# EAGLE design GEO-HEX-1.0.0 (EAGLE 9.6.2)

## Sheet 1 of 4
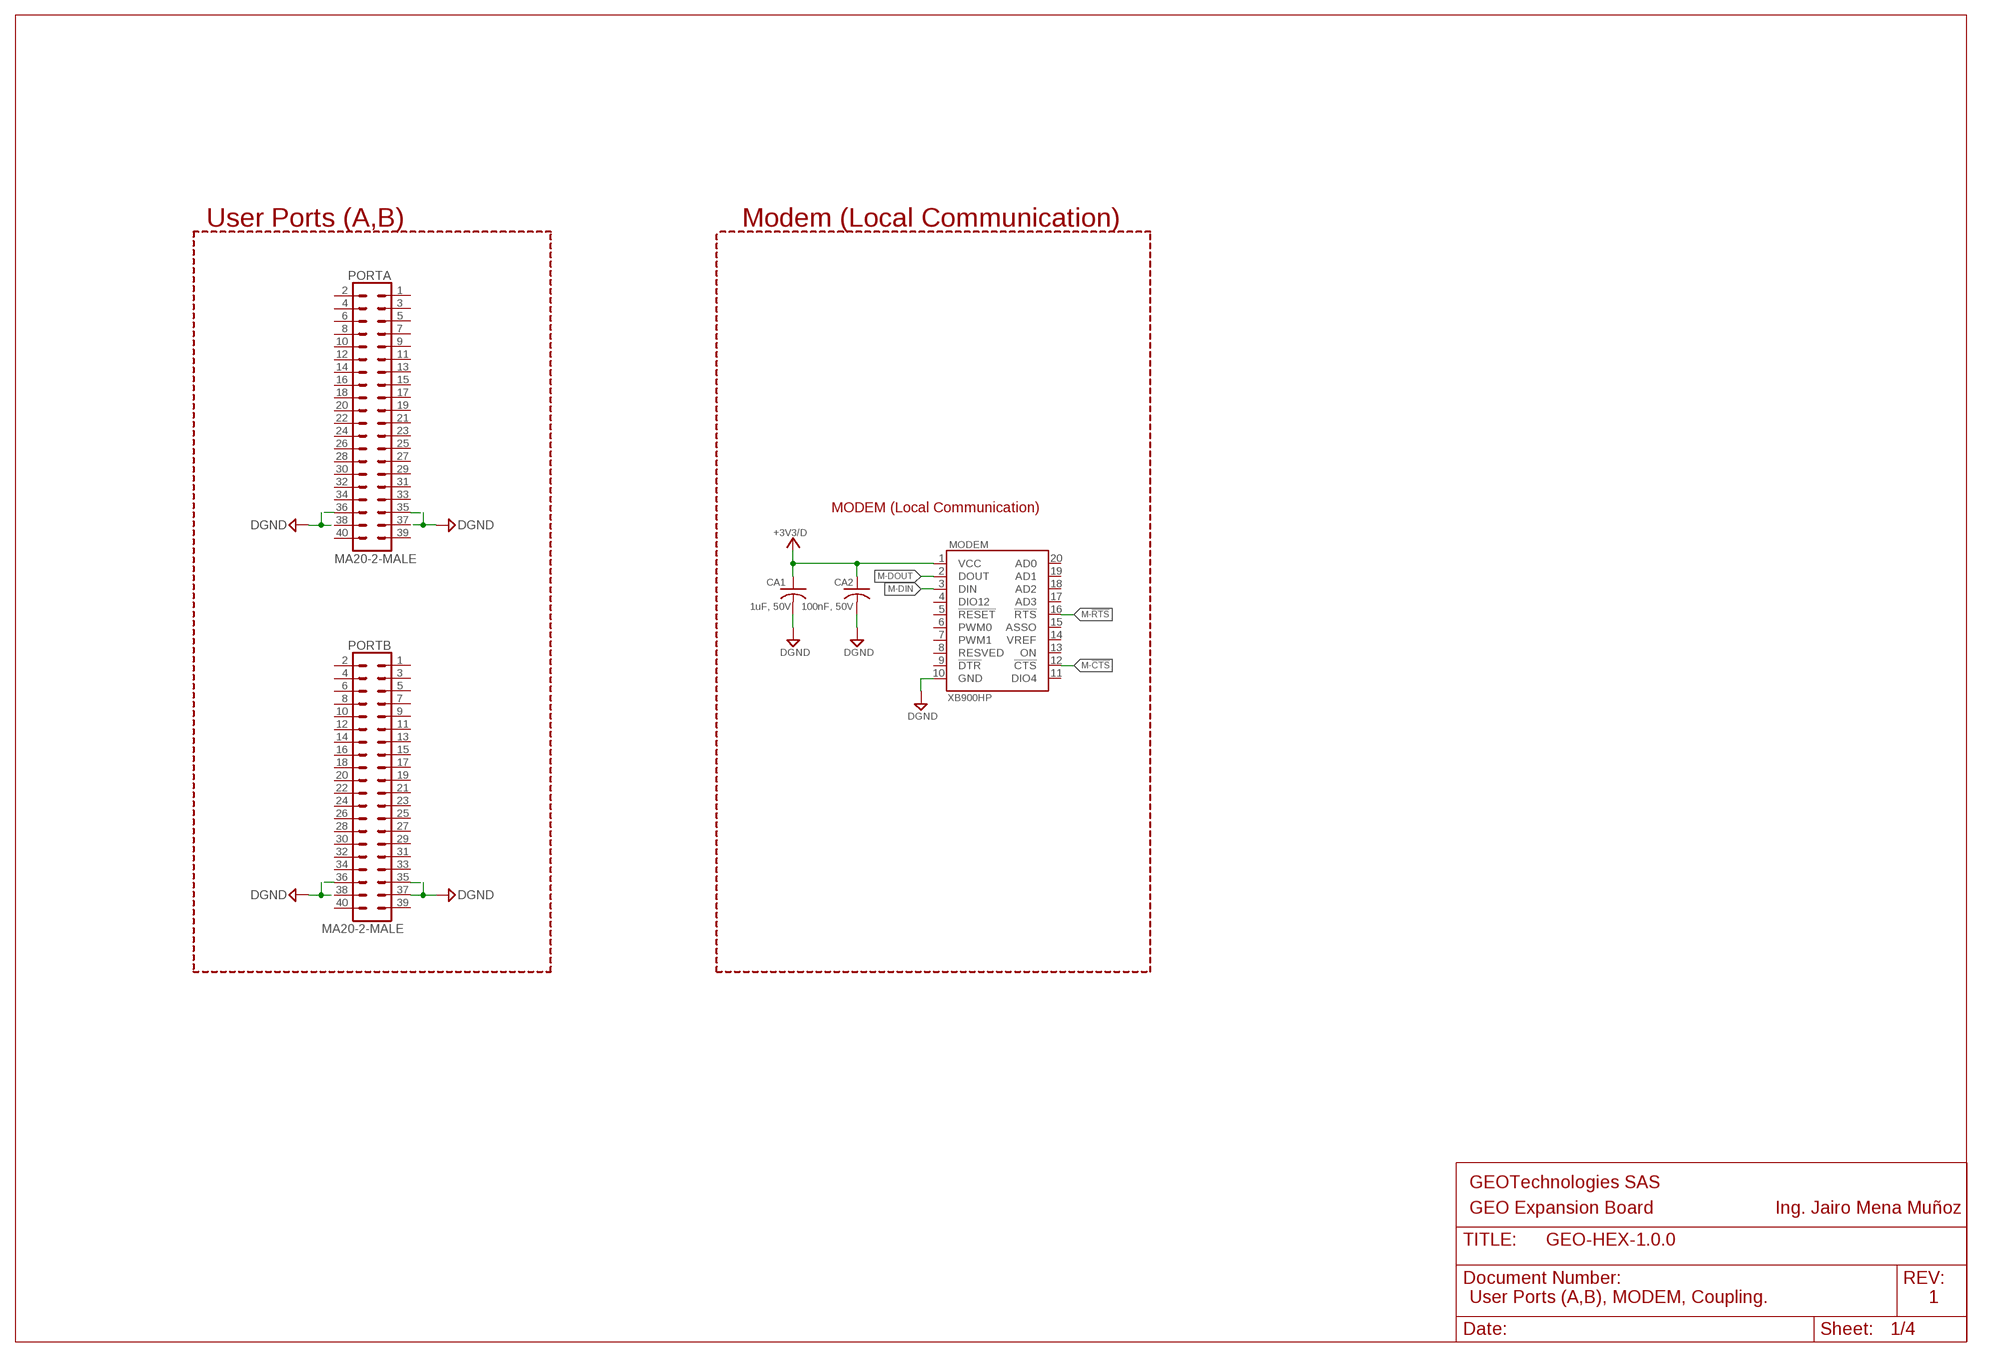
[diagram p0: schematic, sheet 1]

### Parts
CA1  1uF, 50V  C-US1UF-0805  [C0805]
CA2  100nF, 50V  C-US100NF-0805  [C0805]
MODEM  XB900HP  XBEEPROXBP9B-DMST-002  [XBEEPRO]
PORTA  MA20-2-MALE  [MA20-2-MALE]
PORTB  MA20-2-MALE  [MA20-2-MALE]

### Nets
+3V3/D: CA1.1 CA2.1 MODEM.1(VCC) ; also sheet 4
DGND: CA1.2 CA2.2 MODEM.10(GND) PORTA.35 PORTA.36 PORTA.37 PORTA.38 PORTB.35 PORTB.36 PORTB.37 PORTB.38
M-!CTS: MODEM.12(!CTS)
M-!RTS: MODEM.16(!RTS)
M-DIN: MODEM.3(DIN)
M-DOUT: MODEM.2(DOUT)
Unconnected: MODEM.4(DIO12) MODEM.5(!RESET) MODEM.6(PWM0) MODEM.7(PWM1) MODEM.8(RESVED) MODEM.9(!DTR) MODEM.11(DIO4) MODEM.13(ON) MODEM.14(VREF) MODEM.15(ASSO) MODEM.17(AD3) MODEM.18(AD2) MODEM.19(AD1) MODEM.20(AD0) PORTA.1 PORTA.2 PORTA.3 PORTA.4 PORTA.5 PORTA.6 PORTA.7 PORTA.8 PORTA.9 PORTA.10 PORTA.11 PORTA.12 PORTA.13 PORTA.14 PORTA.15 PORTA.16 PORTA.17 PORTA.18 PORTA.19 PORTA.20 PORTA.21 PORTA.22 PORTA.23 PORTA.24 PORTA.25 PORTA.26 PORTA.27 PORTA.28 PORTA.29 PORTA.30 PORTA.31 PORTA.32 PORTA.33 PORTA.34 PORTA.39 PORTA.40 PORTB.1 PORTB.2 PORTB.3 PORTB.4 PORTB.5 PORTB.6 PORTB.7 PORTB.8 PORTB.9 PORTB.10 PORTB.11 PORTB.12 PORTB.13 PORTB.14 PORTB.15 PORTB.16 PORTB.17 PORTB.18 PORTB.19 PORTB.20 PORTB.21 PORTB.22 PORTB.23 PORTB.24 PORTB.25 PORTB.26 PORTB.27 PORTB.28 PORTB.29 PORTB.30 PORTB.31 PORTB.32 PORTB.33 PORTB.34 PORTB.39 PORTB.40

### Notes on the sheet
- User Ports (A,B) | Modem (Local Communication)
- MODEM (Local Communication)
- GEOTechnologies SAS
- GEO Expansion Board | Ing. Jairo Mena Muñoz
- User Ports (A,B), MODEM, Coupling. | 1

## Sheet 2 of 4
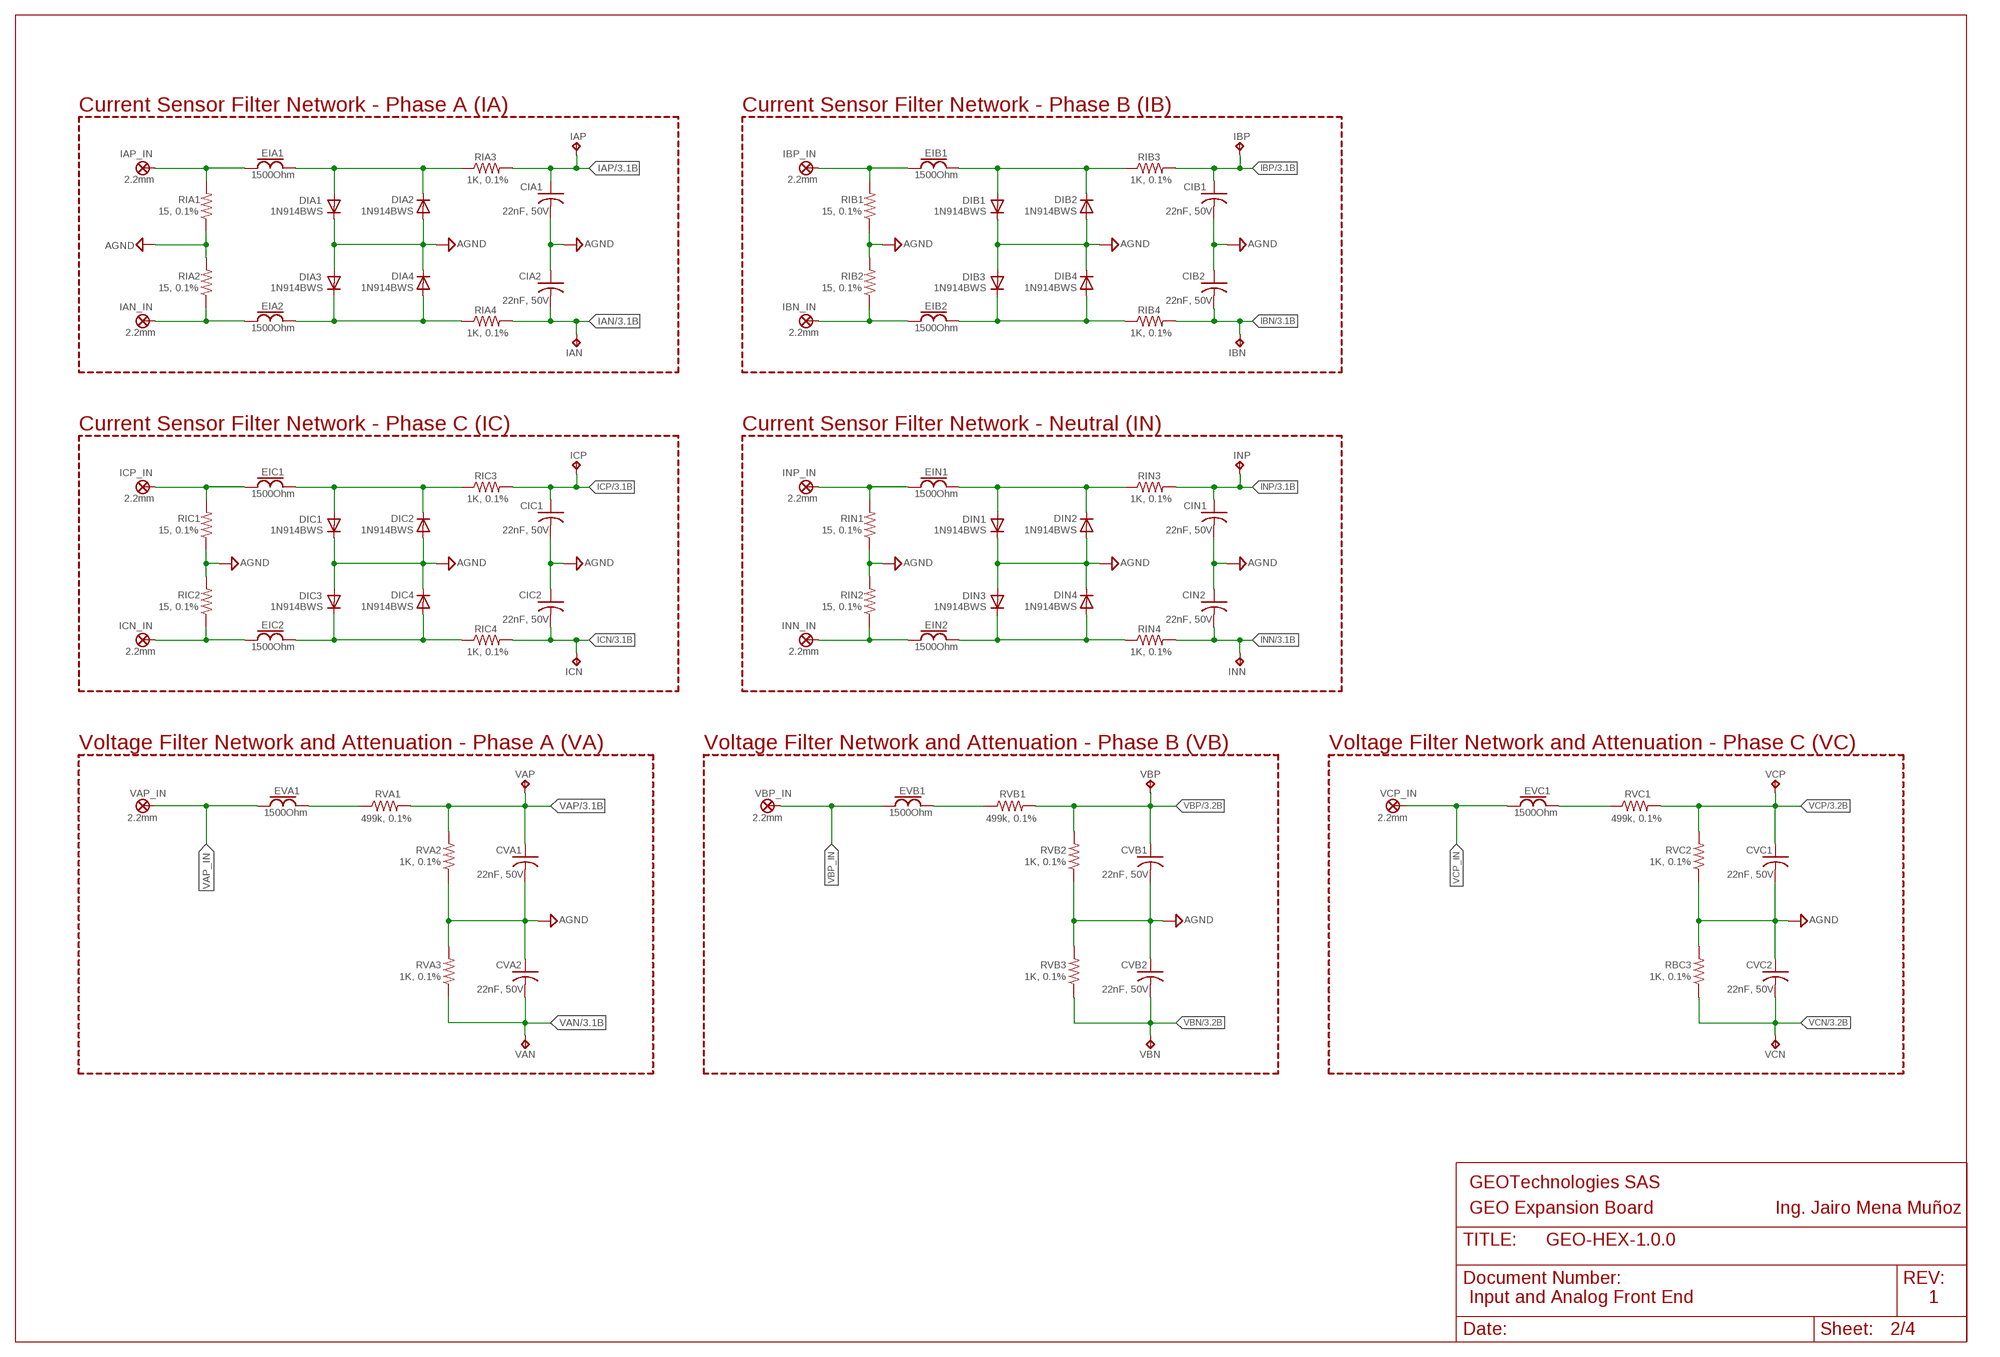
[diagram p1: schematic, sheet 2]

### Parts
CIA1  22nF, 50V  C-US22NF-0805  [C0805]
CIA2  22nF, 50V  C-US22NF-0805  [C0805]
CIB1  22nF, 50V  C-US22NF-0805  [C0805]
CIB2  22nF, 50V  C-US22NF-0805  [C0805]
CIC1  22nF, 50V  C-US22NF-0805  [C0805]
CIC2  22nF, 50V  C-US22NF-0805  [C0805]
CIN1  22nF, 50V  C-US22NF-0805  [C0805]
CIN2  22nF, 50V  C-US22NF-0805  [C0805]
CVA1  22nF, 50V  C-US22NF-0805  [C0805]
CVA2  22nF, 50V  C-US22NF-0805  [C0805]
CVB1  22nF, 50V  C-US22NF-0805  [C0805]
CVB2  22nF, 50V  C-US22NF-0805  [C0805]
CVC1  22nF, 50V  C-US22NF-0805  [C0805]
CVC2  22nF, 50V  C-US22NF-0805  [C0805]
DIA1  1N914BWS  D1N914BWS  [SOD-323FL]
DIA2  1N914BWS  D1N914BWS  [SOD-323FL]
DIA3  1N914BWS  D1N914BWS  [SOD-323FL]
DIA4  1N914BWS  D1N914BWS  [SOD-323FL]
DIB1  1N914BWS  D1N914BWS  [SOD-323FL]
DIB2  1N914BWS  D1N914BWS  [SOD-323FL]
DIB3  1N914BWS  D1N914BWS  [SOD-323FL]
DIB4  1N914BWS  D1N914BWS  [SOD-323FL]
DIC1  1N914BWS  D1N914BWS  [SOD-323FL]
DIC2  1N914BWS  D1N914BWS  [SOD-323FL]
DIC3  1N914BWS  D1N914BWS  [SOD-323FL]
DIC4  1N914BWS  D1N914BWS  [SOD-323FL]
DIN1  1N914BWS  D1N914BWS  [SOD-323FL]
DIN2  1N914BWS  D1N914BWS  [SOD-323FL]
DIN3  1N914BWS  D1N914BWS  [SOD-323FL]
DIN4  1N914BWS  D1N914BWS  [SOD-323FL]
EIA1  1500Ohm  FBL0805  [L0805]
EIA2  1500Ohm  FBL0805  [L0805]
EIB1  1500Ohm  FBL0805  [L0805]
EIB2  1500Ohm  FBL0805  [L0805]
EIC1  1500Ohm  FBL0805  [L0805]
EIC2  1500Ohm  FBL0805  [L0805]
EIN1  1500Ohm  FBL0805  [L0805]
EIN2  1500Ohm  FBL0805  [L0805]
EVA1  1500Ohm  FBL0805  [L0805]
EVB1  1500Ohm  FBL0805  [L0805]
EVC1  1500Ohm  FBL0805  [L0805]
IAN  TPPAD1-13  [P1-10]
IAN_IN  2.2mm  TURRET  [TURRET]
IAP  TPPAD1-13  [P1-10]
IAP_IN  2.2mm  TURRET  [TURRET]
IBN  TPPAD1-13  [P1-10]
IBN_IN  2.2mm  TURRET  [TURRET]
IBP  TPPAD1-13  [P1-10]
IBP_IN  2.2mm  TURRET  [TURRET]
ICN  TPPAD1-13  [P1-10]
ICN_IN  2.2mm  TURRET  [TURRET]
ICP  TPPAD1-13  [P1-10]
ICP_IN  2.2mm  TURRET  [TURRET]
INN  TPPAD1-13  [P1-10]
INN_IN  2.2mm  TURRET  [TURRET]
INP  TPPAD1-13  [P1-10]
INP_IN  2.2mm  TURRET  [TURRET]
RBC3  1K, 0.1%  R-US1KR0805  [R0805]
RIA1  15, 0.1%  R-US15R0805  [R0805]
RIA2  15, 0.1%  R-US15R0805  [R0805]
RIA3  1K, 0.1%  R-US1KR0805  [R0805]
RIA4  1K, 0.1%  R-US1KR0805  [R0805]
RIB1  15, 0.1%  R-US15R0805  [R0805]
RIB2  15, 0.1%  R-US15R0805  [R0805]
RIB3  1K, 0.1%  R-US1KR0805  [R0805]
RIB4  1K, 0.1%  R-US1KR0805  [R0805]
RIC1  15, 0.1%  R-US15R0805  [R0805]
RIC2  15, 0.1%  R-US15R0805  [R0805]
RIC3  1K, 0.1%  R-US1KR0805  [R0805]
RIC4  1K, 0.1%  R-US1KR0805  [R0805]
RIN1  15, 0.1%  R-US15R0805  [R0805]
RIN2  15, 0.1%  R-US15R0805  [R0805]
RIN3  1K, 0.1%  R-US1KR0805  [R0805]
RIN4  1K, 0.1%  R-US1KR0805  [R0805]
RVA1  499k, 0.1%  R-US499KR1206  [R1206]
RVA2  1K, 0.1%  R-US1KR0805  [R0805]
RVA3  1K, 0.1%  R-US1KR0805  [R0805]
RVB1  499k, 0.1%  R-US499KR1206  [R1206]
RVB2  1K, 0.1%  R-US1KR0805  [R0805]
RVB3  1K, 0.1%  R-US1KR0805  [R0805]
RVC1  499k, 0.1%  R-US499KR1206  [R1206]
RVC2  1K, 0.1%  R-US1KR0805  [R0805]
VAN  TPPAD1-13  [P1-10]
VAP  TPPAD1-13  [P1-10]
VAP_IN  2.2mm  TURRET  [TURRET]
VBN  TPPAD1-13  [P1-10]
VBP  TPPAD1-13  [P1-10]
VBP_IN  2.2mm  TURRET  [TURRET]
VCN  TPPAD1-13  [P1-10]
VCP  TPPAD1-13  [P1-10]
VCP_IN  2.2mm  TURRET  [TURRET]

### Nets
AGND: CIA1.2 CIA2.1 CIB1.2 CIB2.1 CIC1.2 CIC2.1 CIN1.2 CIN2.1 CVA1.2 CVA2.1 CVB1.2 CVB2.1 CVC1.2 CVC2.1 DIA1.C DIA2.A DIA3.A DIA4.C DIB1.C DIB2.A DIB3.A DIB4.C DIC1.C DIC2.A DIC3.A DIC4.C DIN1.C DIN2.A DIN3.A DIN4.C RBC3.2 RIA1.1 RIA2.2 RIB1.1 RIB2.2 RIC1.1 RIC2.2 RIN1.1 RIN2.2 RVA2.1 RVA3.2 RVB2.1 RVB3.2 RVC2.1 ; also sheet 3,4
IAN: CIA2.2 IAN.TP RIA4.2 ; also sheet 3
IAP: CIA1.1 IAP.TP RIA3.2 ; also sheet 3
IBN: CIB2.2 IBN.TP RIB4.2 ; also sheet 3
IBP: CIB1.1 IBP.TP RIB3.2 ; also sheet 3
ICN: CIC2.2 ICN.TP RIC4.2 ; also sheet 3
ICP: CIC1.1 ICP.TP RIC3.2 ; also sheet 3
INN: CIN2.2 INN.TP RIN4.2 ; also sheet 3
INP: CIN1.1 INP.TP RIN3.2 ; also sheet 3
N$3: EVA1.2 RVA1.1
N$5: EIA1.1 IAP_IN.P1 RIA1.2
N$6: EIA2.1 IAN_IN.P1 RIA2.1
N$14: DIA1.A DIA2.C EIA1.2 RIA3.1
N$15: DIA3.C DIA4.A EIA2.2 RIA4.1
N$23: EIB1.1 IBP_IN.P1 RIB1.2
N$26: EIB2.1 IBN_IN.P1 RIB2.1
N$27: DIB1.A DIB2.C EIB1.2 RIB3.1
N$30: DIB3.C DIB4.A EIB2.2 RIB4.1
N$32: EIC1.1 ICP_IN.P1 RIC1.2
N$33: EIC2.1 ICN_IN.P1 RIC2.1
N$34: DIC1.A DIC2.C EIC1.2 RIC3.1
N$35: DIC3.C DIC4.A EIC2.2 RIC4.1
N$36: EVB1.2 RVB1.1
N$37: EVC1.2 RVC1.1
N$51: EIN1.1 INP_IN.P1 RIN1.2
N$52: EIN2.1 INN_IN.P1 RIN2.1
N$53: DIN1.A DIN2.C EIN1.2 RIN3.1
N$54: DIN3.C DIN4.A EIN2.2 RIN4.1
VAN: CVA2.2 RVA3.1 VAN.TP ; also sheet 3
VAP: CVA1.1 RVA1.2 RVA2.2 VAP.TP ; also sheet 3
VAP_IN: EVA1.1 VAP_IN.P1
VBN: CVB2.2 RVB3.1 VBN.TP ; also sheet 3
VBP: CVB1.1 RVB1.2 RVB2.2 VBP.TP ; also sheet 3
VBP_IN: EVB1.1 VBP_IN.P1
VCN: CVC2.2 RBC3.1 VCN.TP ; also sheet 3
VCP: CVC1.1 RVC1.2 RVC2.2 VCP.TP ; also sheet 3
VCP_IN: EVC1.1 VCP_IN.P1

### Notes on the sheet
- Current Sensor Filter Network - Phase A (IA) | Current Sensor Filter Network - Phase B (IB)
- Current Sensor Filter Network - Phase C (IC) | Current Sensor Filter Network - Neutral (IN)
- Voltage Filter Network and Attenuation - Phase A (VA) | Voltage Filter Network and Attenuation - Phase B (VB) | Voltage Filter Network and Attenuation - Phase C (VC)
- GEOTechnologies SAS
- GEO Expansion Board | Ing. Jairo Mena Muñoz
- Input and Analog Front End | 1

## Sheet 3 of 4
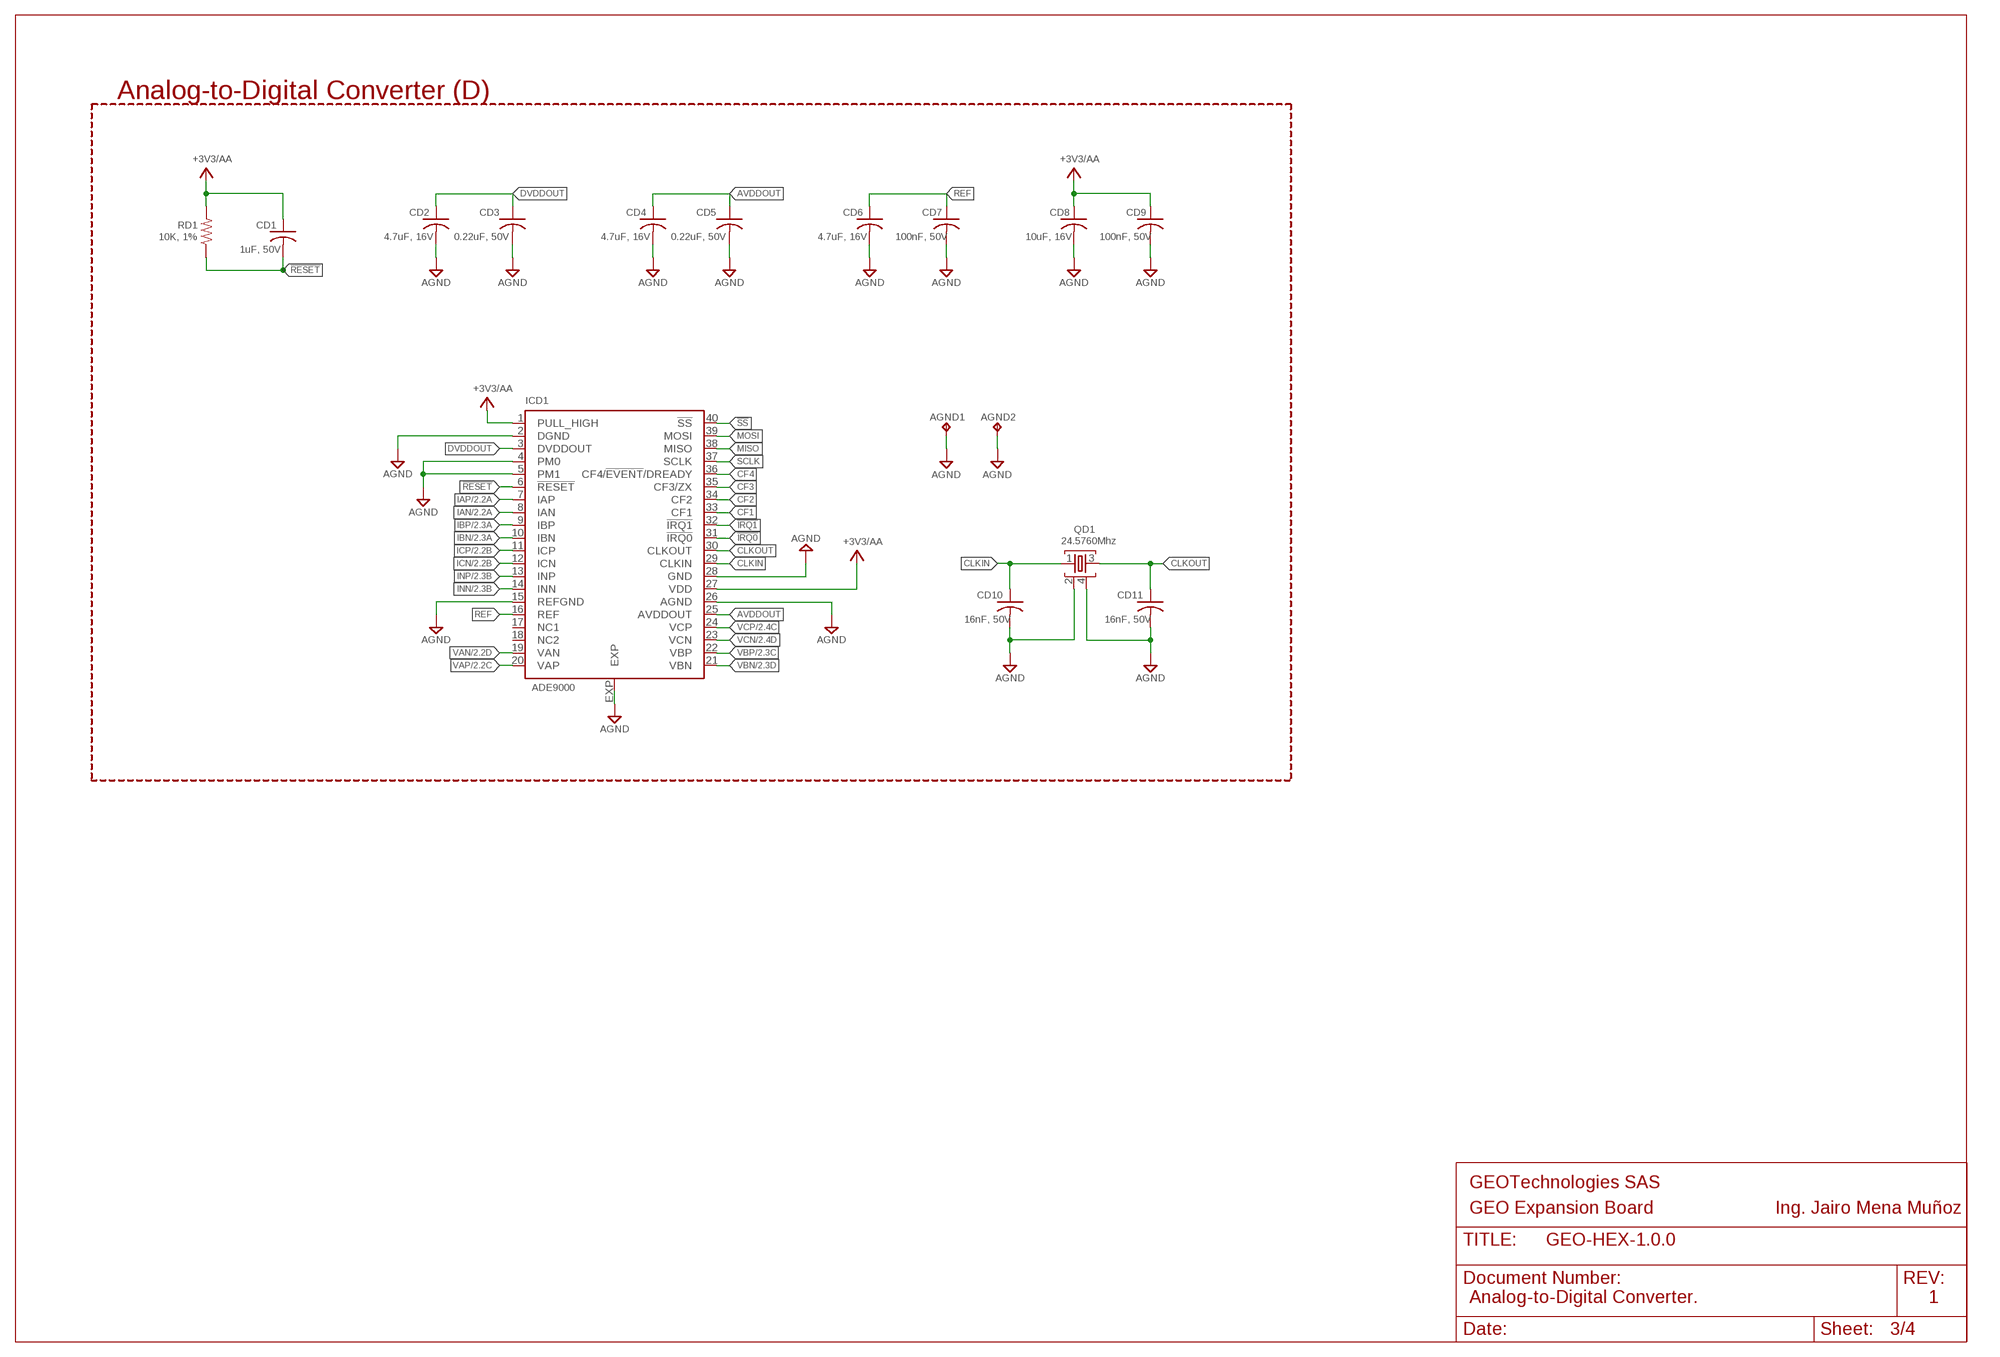
[diagram p2: schematic, sheet 3]

### Parts
AGND1  TPPAD1-13  [P1-10]
AGND2  TPPAD1-13  [P1-10]
CD1  1uF, 50V  C-US1UF-0805  [C0805]
CD2  4.7uF, 16V  C-US4.7UF-0805  [C0805]
CD3  0.22uF, 50V  C-US0.22UF-0805  [C0805]
CD4  4.7uF, 16V  C-US4.7UF-0805  [C0805]
CD5  0.22uF, 50V  C-US0.22UF-0805  [C0805]
CD6  4.7uF, 16V  C-US4.7UF-0805  [C0805]
CD7  100nF, 50V  C-US100NF-0805  [C0805]
CD8  10uF, 16V  C-US10UF-0805  [C0805]
CD9  100nF, 50V  C-US100NF-0805  [C0805]
CD10  16nF, 50V  C-US16PF-0805  [C0805]
CD11  16nF, 50V  C-US16PF-0805  [C0805]
ICD1  ADE9000  [LFCSP40]
QD1  24.5760Mhz  Q-SHIELD  [4-SMD]
RD1  10K, 1%  R-US10KR0805  [R0805]

### Nets
!IRQ0: ICD1.31(!IRQ0)
!IRQ1: ICD1.32(!IRQ1)
!RESET: CD1.2 ICD1.6(!RESET) RD1.1
!SS: ICD1.40(!SS)
+3V3/AA: CD1.1 CD8.1 CD9.1 ICD1.1(PULL_HIGH) ICD1.27(VDD) RD1.2 ; also sheet 4
AGND: AGND1.TP AGND2.TP CD2.2 CD3.2 CD4.2 CD5.2 CD6.2 CD7.2 CD8.2 CD9.2 CD10.2 CD11.2 ICD1.2(DGND) ICD1.4(PM0) ICD1.5(PM1) ICD1.15(REFGND) ICD1.26(AGND) ICD1.28(GND) ICD1.EXP QD1.2 QD1.4 ; also sheet 2,4
AVDDOUT: CD4.1 CD5.1 ICD1.25(AVDDOUT)
CF1: ICD1.33(CF1)
CF2: ICD1.34(CF2)
CF3: ICD1.35(CF3/ZX)
CF4: ICD1.36(CF4/!EVENT!/DREADY)
CLKIN: CD10.1 ICD1.29(CLKIN) QD1.1
CLKOUT: CD11.1 ICD1.30(CLKOUT) QD1.3
DVDDOUT: CD2.1 CD3.1 ICD1.3(DVDDOUT)
IAN: ICD1.8(IAN) ; also sheet 2
IAP: ICD1.7(IAP) ; also sheet 2
IBN: ICD1.10(IBN) ; also sheet 2
IBP: ICD1.9(IBP) ; also sheet 2
ICN: ICD1.12(ICN) ; also sheet 2
ICP: ICD1.11(ICP) ; also sheet 2
INN: ICD1.14(INN) ; also sheet 2
INP: ICD1.13(INP) ; also sheet 2
MISO: ICD1.38(MISO)
MOSI: ICD1.39(MOSI)
REF: CD6.1 CD7.1 ICD1.16(REF)
SCLK: ICD1.37(SCLK)
VAN: ICD1.19(VAN) ; also sheet 2
VAP: ICD1.20(VAP) ; also sheet 2
VBN: ICD1.21(VBN) ; also sheet 2
VBP: ICD1.22(VBP) ; also sheet 2
VCN: ICD1.23(VCN) ; also sheet 2
VCP: ICD1.24(VCP) ; also sheet 2
Unconnected: ICD1.17(NC1) ICD1.18(NC2)

### Notes on the sheet
- Analog-to-Digital Converter (D)
- GEOTechnologies SAS
- GEO Expansion Board | Ing. Jairo Mena Muñoz
- Analog-to-Digital Converter. | 1

## Sheet 4 of 4
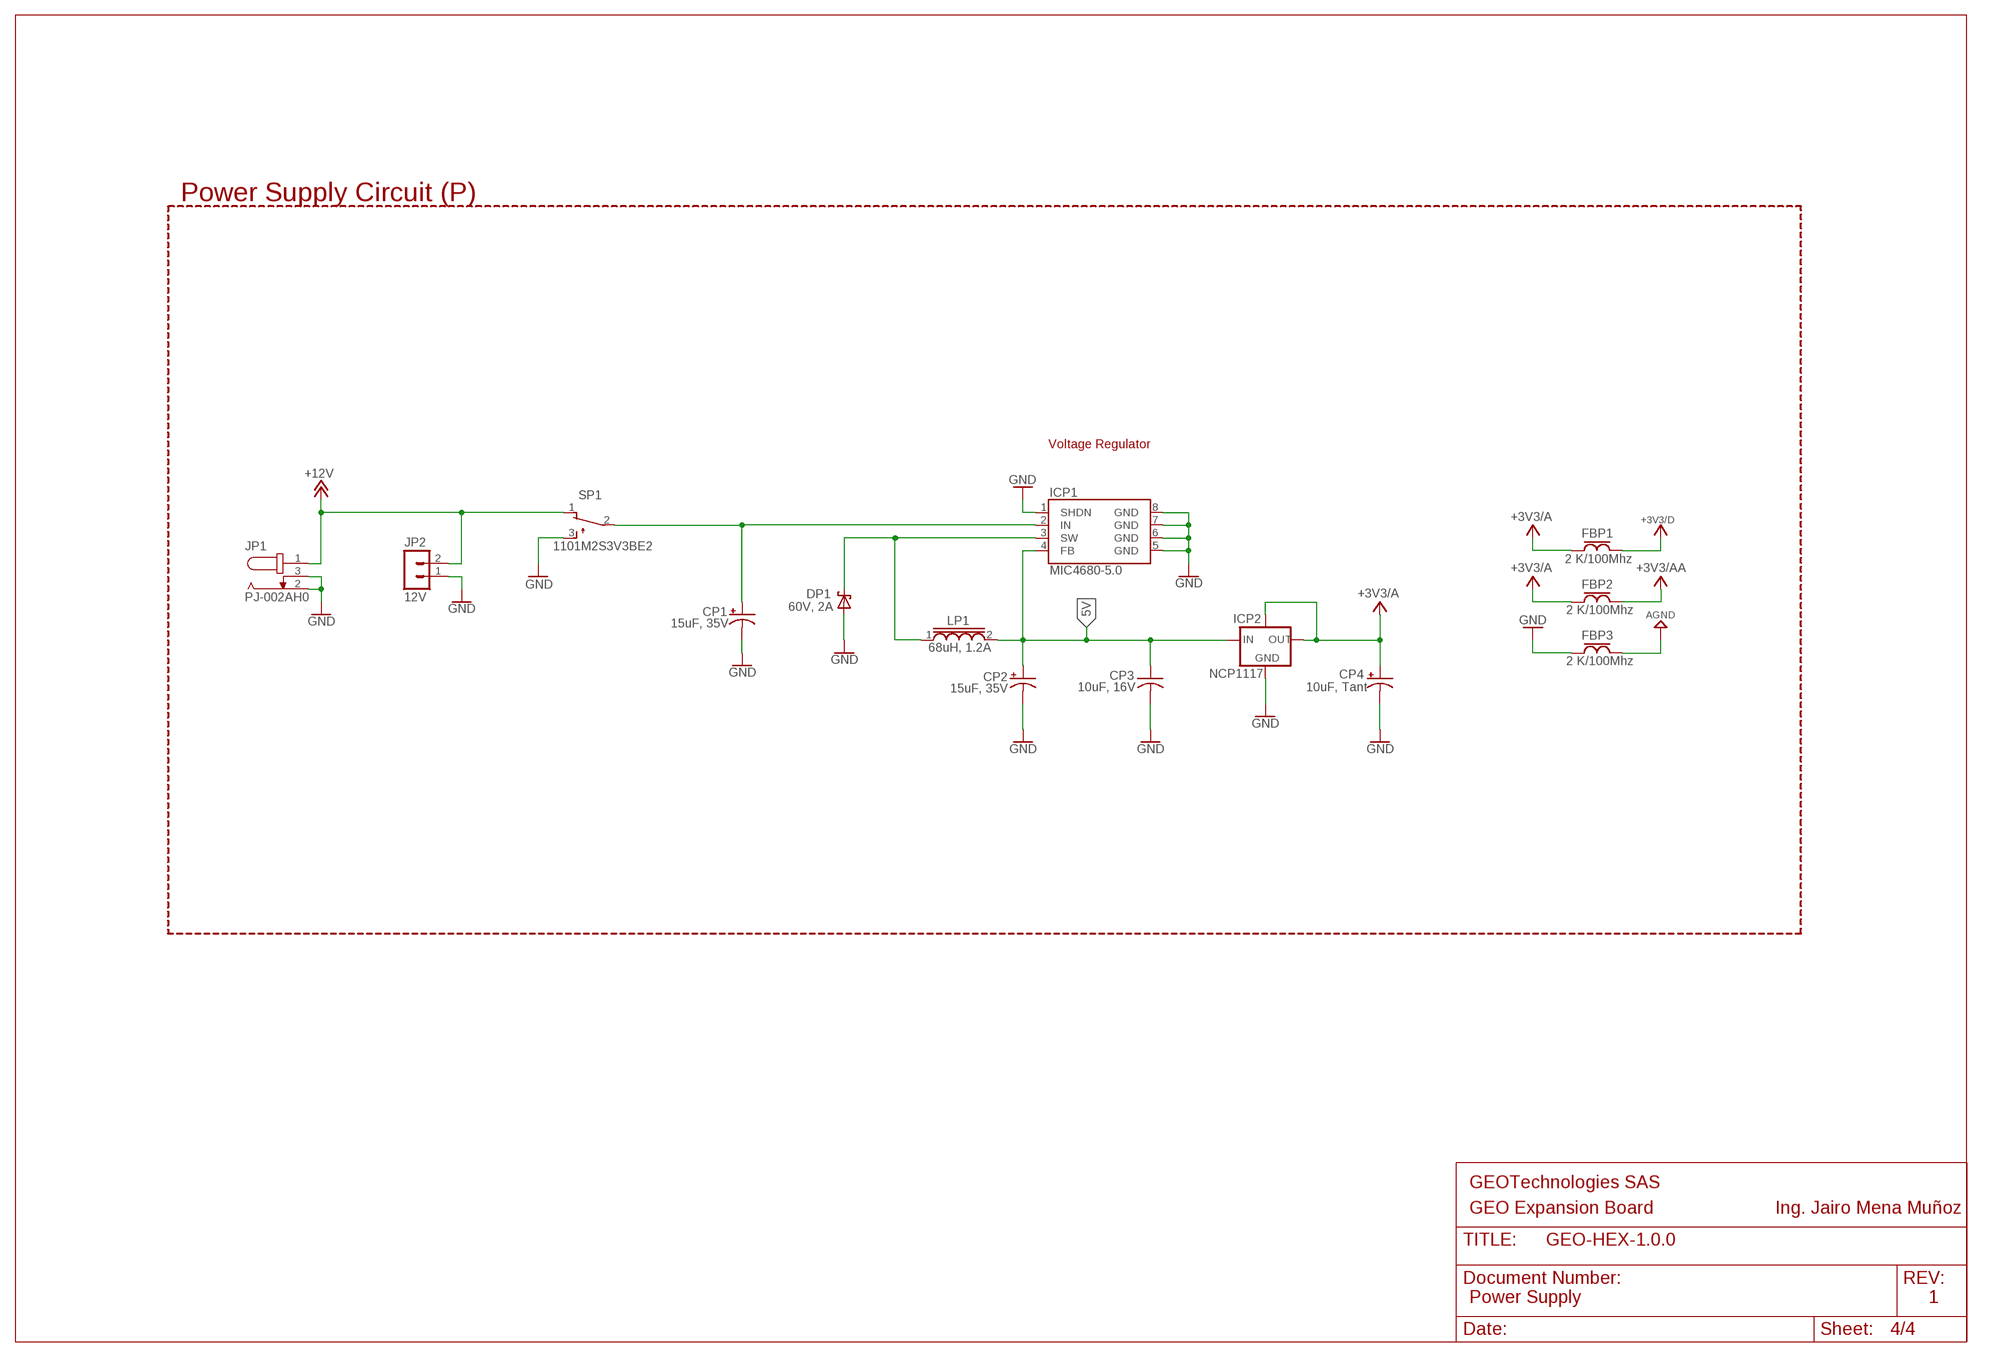
[diagram p3: schematic, sheet 4]

### Parts
CP1  15uF, 35V  C-POLSMCD  [SMC_D]
CP2  15uF, 35V  C-POLSMCD  [SMC_D]
CP3  10uF, 16V  C-US10UF-0805  [C0805]
CP4  10uF, Tant  C-POLSMCP  [SMC_P]
DP1  60V, 2A  DSB260A  [2-SMD]
FBP1  2 K/100Mhz  FBL1210  [L1210]
FBP2  2 K/100Mhz  FBL1210  [L1210]
FBP3  2 K/100Mhz  FBL1210  [L1210]
ICP1  MIC4680-5.0  MIC4680  [SO8]
ICP2  NCP1117  [SOT223]
JP1  PJ-002AH0  [JACK]
JP2  12V  PW2  [PW2]
LP1  68uH, 1.2A  LVLP8040T-680M  [DR7X7]
SP1  1101M2S3V3BE2  [1101M2S3V3BE2]

### Nets
5V: CP2.+ CP3.1 ICP1.4(FB) ICP2.3(IN) LP1.2
+3V3/A: CP4.+ FBP1.1 FBP2.1 ICP2.2(OUT) ICP2.4(TAB)
+3V3/AA: FBP2.2 ; also sheet 3
+3V3/D: FBP1.2 ; also sheet 1
+12V: JP1.1 JP2.2 SP1.1
AGND: FBP3.2 ; also sheet 2,3
GND: CP1.- CP2.- CP3.2 CP4.- DP1.A FBP3.1 ICP1.1(SHDN) ICP1.5(GND) ICP1.6(GND) ICP1.7(GND) ICP1.8(GND) ICP2.1(AGND) JP1.2 JP1.3 JP2.1 SP1.3
N$1: CP1.+ ICP1.2(IN) SP1.2
SW: DP1.C ICP1.3(SW) LP1.1

### Notes on the sheet
- Power Supply Circuit (P)
- Voltage Regulator
- GEOTechnologies SAS
- GEO Expansion Board | Ing. Jairo Mena Muñoz
- Power Supply | 1

## Library data of the parts
AGND1 AGND2 IAN IAP IBN IBP ICN ICP INN INP VAN VAP VBN VBP VCN VCP = SIMI-E:TP: Test Point PC Test Point Terminal, 0.039" (1.00mm) Hole Diameter; PART-NUMBER: 36-1040-ND; SOURCE: Digikey; SOURCE-DESCRIPTION: PC Test Point, Slotted Brass, Tin Plating 0.039" (1.00mm) Hole Diameter Mounting Type
CA1 CD1 = SIMI-E:C-US: Ceramic Capacitor, American symbol; PART-NUMBER: 1276-1029-1-ND; SOURCE: Digikey; SOURCE-DESCRIPTION: 1µF ±10% 50V Ceramic Capacitor X7R 0805 (2012 Metric)
CA2 CD7 CD9 = SIMI-E:C-US: Ceramic Capacitor, American symbol; PART-NUMBER: 478-3352-1-ND; SOURCE: Digikey; SOURCE-DESCRIPTION: 0.1µF ±5% 50V Ceramic Capacitor X7R 0805 (2012 Metric)
CD2 CD4 CD6 = SIMI-E:C-US: Ceramic Capacitor, American symbol; PART-NUMBER: 1276-2972-1-ND; SOURCE: Digikey; SOURCE-DESCRIPTION: 4.7µF ±10% 10V Ceramic Capacitor X7R 0805 (2012 Metric)
CD3 CD5 = SIMI-E:C-US: Ceramic Capacitor, American symbol; PART-NUMBER: 732-7675-1-ND; SOURCE: Digikey; SOURCE-DESCRIPTION: 0.22µF ±10% 50V Ceramic Capacitor X7R 0805 (2012 Metric)
CD8 CP3 = SIMI-E:C-US: Ceramic Capacitor, American symbol; PART-NUMBER: 1276-2872-1-ND; SOURCE: Digikey; SOURCE-DESCRIPTION: 10µF ±10% 16V Ceramic Capacitor X7R 0805 (2012 Metric)
CD10 CD11 = SIMI-E:C-US: Ceramic Capacitor, American symbol; PART-NUMBER: 399-15455-1-ND; SOURCE: Digikey; SOURCE-DESCRIPTION: 16pF ±5% 50V Ceramic Capacitor C0G, NP0 0805 (2012 Metric)
CIA1 CIA2 CIB1 CIB2 CIC1 CIC2 CIN1 CIN2 CVA1 CVA2 CVB1 CVB2 CVC1 CVC2 = SIMI-E:C-US: Ceramic Capacitor, American symbol; PART-NUMBER: 1276-1104-1-ND; SOURCE: Digikey; SOURCE-DESCRIPTION: 0.022µF ±10% 50V Ceramic Capacitor X7R 0603 (1608 Metric)
CP1 CP2 = SIMI-E:C-POL: Polarized Capacitor, American symbol; PART-NUMBER: 478-4101-1-ND; SOURCE: Digikey; SOURCE-DESCRIPTION: 15µF Molded Tantalum Capacitors 35V 2917 (7343 Metric) 300 mOhm
CP4 = SIMI-E:C-POL: Polarized Capacitor, American symbol; PART-NUMBER: 478-3281-1-ND; SOURCE: Digikey; SOURCE-DESCRIPTION: 10µF Molded Tantalum Capacitors 10V 0805 (2012 Metric) 6 Ohm
DIA1-DIA4 DIB1-DIB4 DIC1-DIC4 DIN1-DIN4 = SIMI-E:D: Standard Diode Standard, Rectifier and General Purpose; PART-NUMBER: 1N914BWSCT-ND; SOURCE: Digikey; SOURCE-DESCRIPTION: Diode Standard 75V 150mA Surface Mount SOD-323F
DP1 = SIMI-E:DS: Diode Schottky SMD Schottky Barrier Rectifiers. CDBA240-HF Thru. CDBA2100-HF; PART-NUMBER: 641-1699-1-ND; SOURCE: Digikey; SOURCE-DESCRIPTION: Diode Schottky 60V 2A Surface Mount DO-214AC (SMA)
EIA1 EIA2 EIB1 EIB2 EIC1 EIC2 EIN1 EIN2 EVA1 EVB1 EVC1 = SIMI-E:FB: Ferrite Bead; PART-NUMBER: 490-1048-1-ND; SOURCE: Digikey; SOURCE-DESCRIPTION: 1.5 kOhms @ 100MHz 1 Signal Line Ferrite Bead 0805 (2012 Metric) 250mA 450 mOhm
FBP1-FBP3 = SIMI-E:FB: Ferrite Bead; PART-NUMBER: 587-1754-1-ND; SOURCE: Digikey; SOURCE-DESCRIPTION: 2 kOhms @ 100MHz 1 Power Line Ferrite Bead 1210 (3225 Metric) 1.2A 130 mOhm
IAN_IN IAP_IN IBN_IN IBP_IN ICN_IN ICP_IN INN_IN INP_IN VAP_IN VBP_IN VCP_IN = SIMI-E:TURRET: Terminal Turret Connector Single End
ICD1 = SIMI-E:ADE9000: High Performance, Multiphase Energy Power Quality Monitoring IC; PART-NUMBER: ADE9000ACPZ-ND; SOURCE: Digikey; SOURCE-DESCRIPTION: POLYPHASE ENERGY METERING AFE, 7 Channel AFE 40-LFCSP-WQ (6x6)
ICP1 = SIMI-E:MIC4680: Buck-Boost Switching Regulator Positive Fixed 5V 1 Output 1.3A 200kHz; PART-NUMBER: 576-3379-5-ND; SOURCE: Digikey; SOURCE-DESCRIPTION: Buck, Buck-Boost Switching Regulator IC Positive Fixed 5V 1 Output 1.3A 8-SOIC (0.154", 3.90mm Width)
ICP2 = SIMI-E:NCP1117: Low-Dropout Fixed Voltage Regulator Positive Fixed 3.3V 1 Output 1A ±1.0%; PART-NUMBER: NCP1117ST33T3GOSCT-ND; SOURCE: Digikey; SOURCE-DESCRIPTION: Linear Voltage Regulator IC Positive Fixed 1 Output 1A SOT-223
JP1 = pico-cpop:PJ-002AH: MODEL: PJ-002AH │ DESCRIPTION: DC POWER JACK FEATURES • 2.0 mm center pin • 5.0 A rating • right-angle orientation • through hole
JP2 = pico-cpop:PW2: PIN HEADER
LP1 = SIMI-E:L: Fixed Inductor; PART-NUMBER: 445-6584-1-ND; SOURCE: Digikey; SOURCE-DESCRIPTION: 68µH Shielded Wirewound Inductor 1.2A 230 mOhm Max Nonstandard
MODEM = SIMI-E:XBEEPRO: Digi XBEE-PRO® 900HP Long-Range 900MHz OEM RF Module; PART-NUMBER: 602-1299-ND; SOURCE: Digikey; SOURCE-DESCRIPTION: General ISM < 1GHz Transceiver Module 900MHz Antenna Not Included, RP-SMA Through Hole
PORTA PORTB = pico-cpop:MA20-2-MALE: PIN HEADER
QD1 = SIMI-E:Q-SHIELD: CRYSTAL 24.5760MHZ 8PF SMD; PART-NUMBER: 1253-1747-1-ND; SOURCE: Digikey; SOURCE-DESCRIPTION: 24.576MHz ±10ppm Crystal 8pF 50 Ohms 4-SMD, No Lead
RBC3 RIA3 RIA4 RIB3 RIB4 RIC3 RIC4 RIN3 RIN4 RVA2 RVA3 RVB2 RVB3 RVC2 = SIMI-E:R-US: Resistor, American symbol; PART-NUMBER: A110543CT-ND; SOURCE: Digikey; SOURCE-DESCRIPTION: 1 kOhms ±0.1% 0.25W, 1/4W Chip Resistor 0805 (2012 Metric) Thin Film
RD1 = SIMI-E:R-US: Resistor, American symbol; PART-NUMBER: 311-10.0KCRCT-ND; SOURCE: Digikey; SOURCE-DESCRIPTION: 10 kOhms ±1% 0.125W, 1/8W Chip Resistor 0805 (2012 Metric) Moisture Resistant Thick Film
RIA1 RIA2 RIB1 RIB2 RIC1 RIC2 RIN1 RIN2 = SIMI-E:R-US: Resistor, American symbol; PART-NUMBER: A103157CT-ND; SOURCE: Digikey; SOURCE-DESCRIPTION: 15 Ohms ±0.1% 0.1W, 1/10W Chip Resistor 0805 (2012 Metric) Thin Film
RVA1 RVB1 RVC1 = SIMI-E:R-US: Resistor, American symbol; PART-NUMBER: YAG2051CT-ND; SOURCE: Digikey; SOURCE-DESCRIPTION: 499 kOhms ±0.1% 0.25W, 1/4W Chip Resistor 1206 (3216 Metric) Thin Film
SP1 = pico-cpop:1101M2S3V3BE2: 1000 Series Miniature Slide Switches ON - ON Source: http://www.ck-components.com/14394/1000

## Board
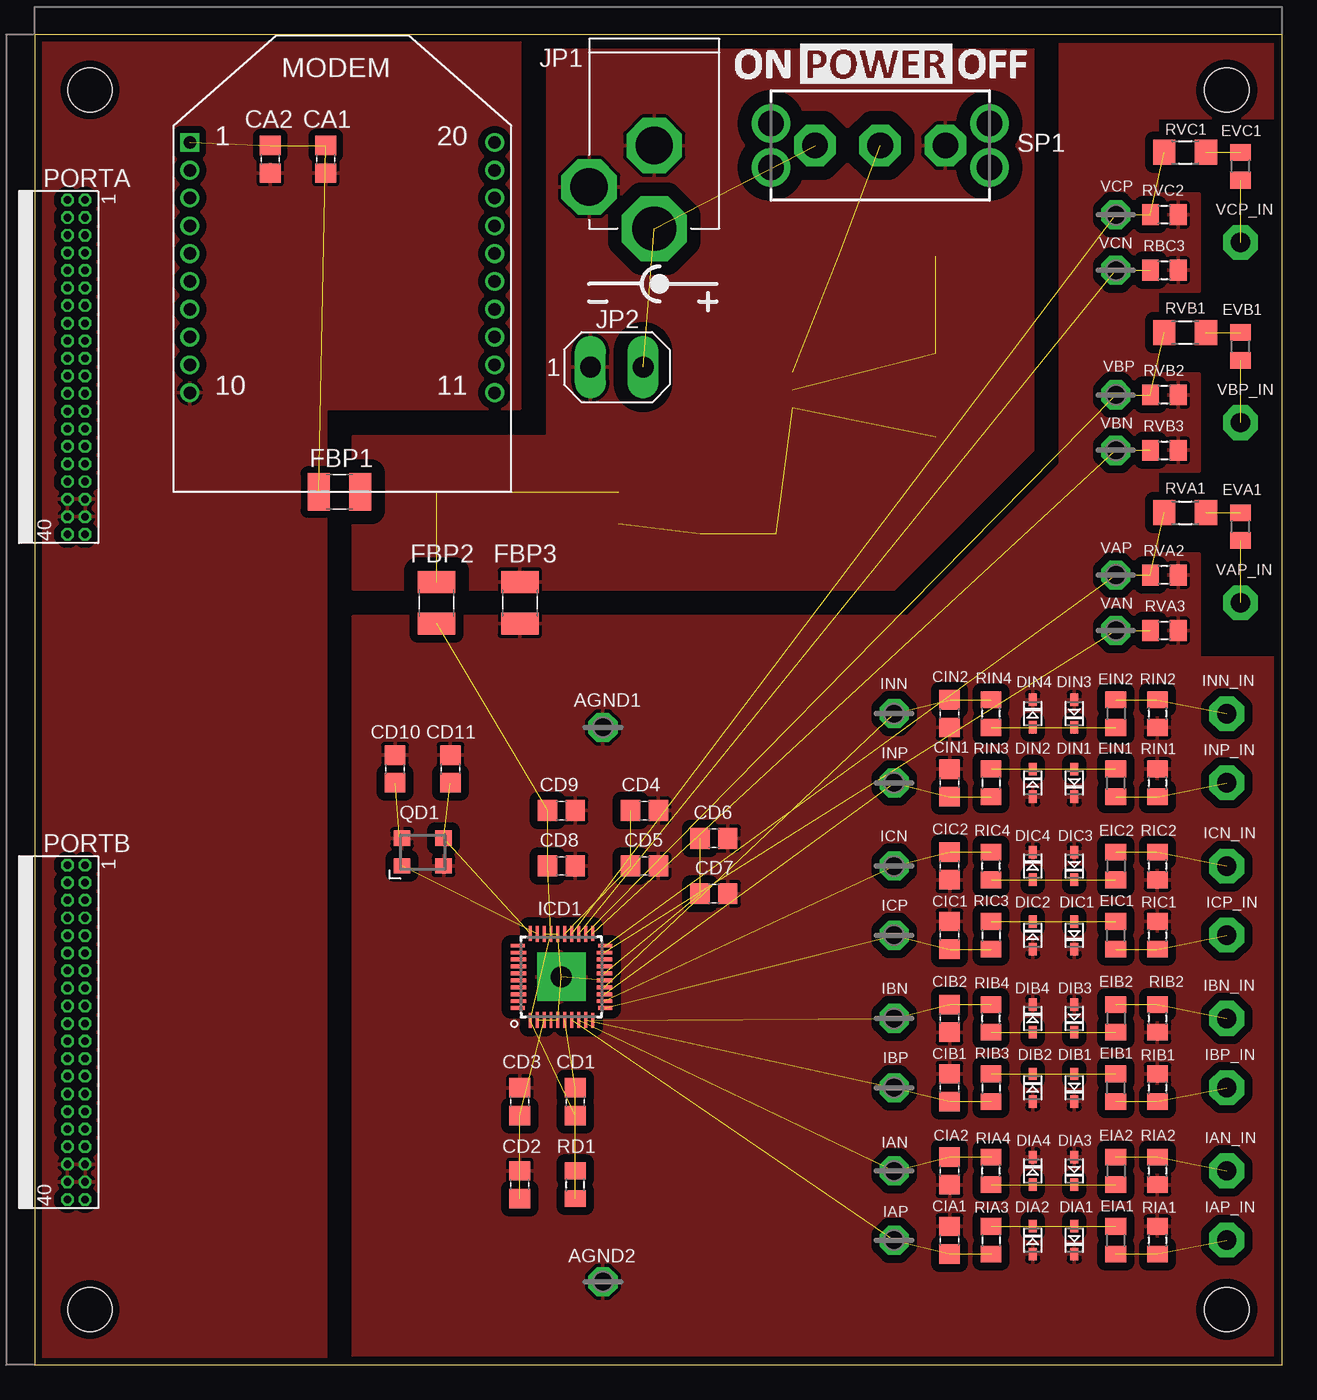
[diagram p4: board, top side]
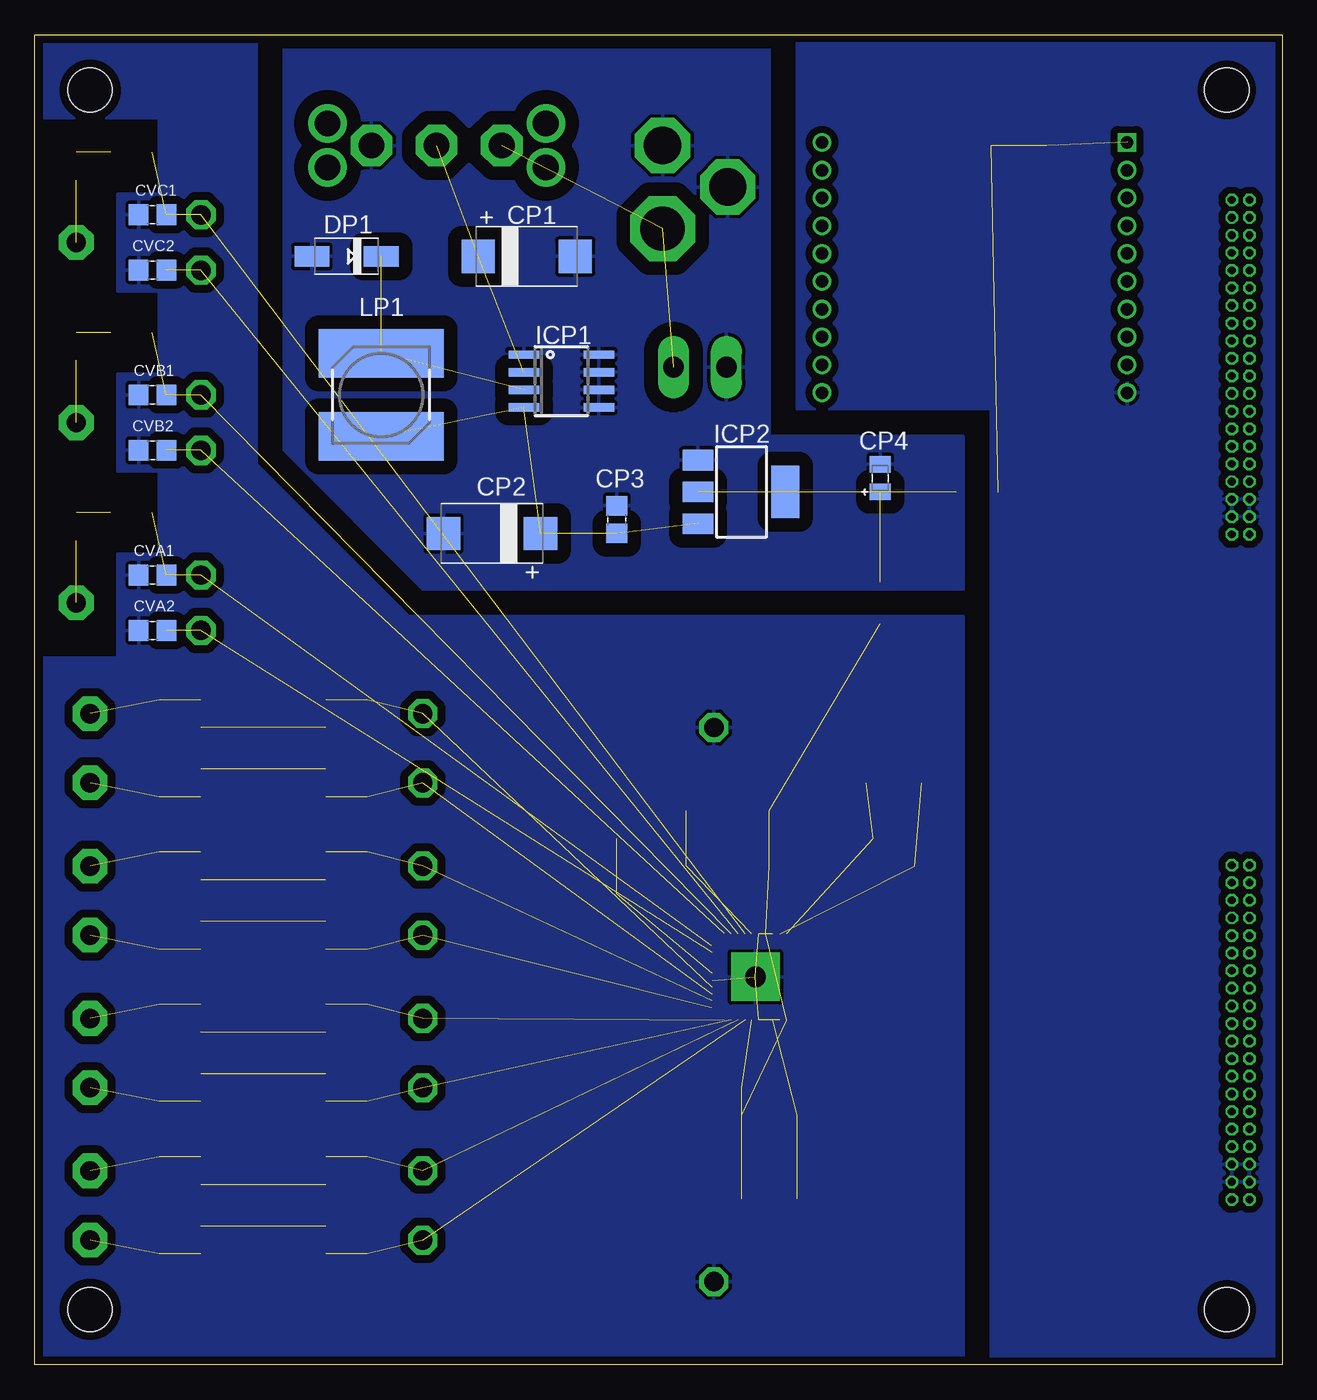
[diagram p5: board, bottom side, seen from below]

Size 90 x 96 mm. Coordinates in mm from the lower left corner, seen from the top.
Outline: 0,0 90,0 90,96 0,96 0,0
Copper layers (1*16): Top 0.035mm / dielectric 1.5mm / Bottom 0.035mm
Design rules "default": minimum track width 5mil, minimum drill 10mil, track to track 5mil, track to pad 5mil, pad to pad 5mil, via to via 5mil, smd to smd 5mil, copper to edge 20mil, drill to drill 8mil, minimum pad ring 5mil, minimum via ring 5mil, stop-mask expansion 2mil, vias tented up to drill 1mm, thermal gap 10mil
Holes 3.2 mm at 4,92 4,4 86,4 86,92

### Footprints (pad centres in the part's own frame; a part is rotated, then mirrored left to right if it is on the bottom)
P1-10 = drill 1.4 pad 2.1 octagon: TP 0,0
C0805 = smd 1.4 x 1.5: 1 -1,0; 2 1,0
SMC_D = smd 2.4 x 2.4: + -3.5,0; - 3.5,0
SMC_P = smd 1.2 x 1.5: + -1,0; - 1,0
SOD-323FL = smd 0.9 x 0.6: A 1,0; C -1,0
2-SMD = smd 2.5 x 1.5: A 2.5,0; C -2.5,0
L0805 = smd 1.2 x 1.5: 1 -1,0; 2 1,0
L1210 = smd 1.6 x 2.7: 1 -1.5,0; 2 1.5,0
TURRET = drill 1.4 pad 2.5 octagon: P1 0,0
LFCSP40 = smd 1.1 x 0.3: 1 -3.15,2.25; 10 -3.15,-2.25; 21 3.15,-2.25; 30 3.15,2.25 | smd 1.2 x 0.3: 2 -3.1,1.75; 3 -3.1,1.25; 4 -3.1,0.75; 5 -3.1,0.25; 6 -3.1,-0.25; 7 -3.1,-0.75; 8 -3.1,-1.25; 9 -3.1,-1.75; 22 3.1,-1.75; 23 3.1,-1.25; 24 3.1,-0.75; 25 3.1,-0.25; 26 3.1,0.25; 27 3.1,0.75; 28 3.1,1.25; 29 3.1,1.75 | smd 0.3 x 1.1: 11 -2.25,-3.15; 20 2.25,-3.15; 31 2.25,3.15; 40 -2.25,3.15 | smd 0.3 x 1.2: 12 -1.75,-3.1; 13 -1.25,-3.1; 14 -0.75,-3.1; 15 -0.25,-3.1; 16 0.25,-3.1; 17 0.75,-3.1; 18 1.25,-3.1; 19 1.75,-3.1; 32 1.75,3.1; 33 1.25,3.1; 34 0.75,3.1; 35 0.25,3.1; 36 -0.25,3.1; 37 -0.75,3.1; 38 -1.25,3.1; 39 -1.75,3.1 | drill 1.5 pad 3.5 square: EXP 0,0
SO8 = smd 0.6 x 2.2: 1 -1.905,-2.7; 2 -0.635,-2.7; 3 0.635,-2.7; 4 1.905,-2.7; 5 1.905,2.7; 6 0.635,2.7; 7 -0.635,2.7; 8 -1.905,2.7
SOT223 = smd 1.5 x 2.2: 1 -2.3,-3.15; 2 0,-3.15; 3 2.3,-3.15 | smd 3.8 x 2: 4 0,3.15
JACK = drill 3.2 pad 4.7 octagon: 1 -3,-4.7 | drill 2.7 pad 4 octagon: 2 3,-4.7; 3 0,0
PW2 = drill 1.5 long: 1 -1.905,0; 2 1.905,0
DR7X7 = smd 9 x 3.5: 1 0,3; 2 0,-3
XBEEPRO = drill 0.9 square: 1 1.194,25.222 | drill 0.9: 2 1.194,23.216; 3 1.194,21.209; 4 1.194,19.202; 5 1.194,17.196; 6 1.194,15.189; 7 1.194,13.183; 8 1.194,11.176; 9 1.194,9.169; 10 1.194,7.163; 11 23.19,7.163; 12 23.19,9.169; 13 23.19,11.176; 14 23.19,13.183; 15 23.19,15.189; 16 23.19,17.196; 17 23.19,19.202; 18 23.19,21.209; 19 23.19,23.216; 20 23.19,25.222
MA20-2-MALE = drill 0.55 pad 0.9 octagon: 1 12.065,-0.635; 2 12.065,0.635; 3 10.795,-0.635; 4 10.795,0.635; 5 9.525,-0.635; 6 9.525,0.635; 7 8.255,-0.635; 8 8.255,0.635; 9 6.985,-0.635; 10 6.985,0.635; 11 5.715,-0.635; 12 5.715,0.635; 13 4.445,-0.635; 14 4.445,0.635; 15 3.175,-0.635; 16 3.175,0.635; 17 1.905,-0.635; 18 1.905,0.635; 19 0.635,-0.635; 20 0.635,0.635; 21 -0.635,-0.635; 22 -0.635,0.635; 23 -1.905,-0.635; 24 -1.905,0.635; 25 -3.175,-0.635; 26 -3.175,0.635; 27 -4.445,-0.635; 28 -4.445,0.635; 29 -5.715,-0.635; 30 -5.715,0.635; 31 -6.985,-0.635; 32 -6.985,0.635; 33 -8.255,-0.635; 34 -8.255,0.635; 35 -9.525,-0.635; 36 -9.525,0.635; 37 -10.795,-0.635; 38 -10.795,0.635; 39 -12.065,-0.635; 40 -12.065,0.635
4-SMD = smd 1.2 x 1.1: 1 -1.5,-1; 2 1.5,-1; 3 1.5,1; 4 -1.5,1
R0805 = smd 1.2 x 1.5: 1 -1,0; 2 1,0
R1206 = smd 1.6 x 1.803: 1 -1.5,0; 2 1.5,0
1101M2S3V3BE2 = drill 1.85 pad 3 octagon: 1 0,-4.7; 2 0,0; 3 0,4.7 | drill 1.85 pad 2.5: M1 -1.59,-7.875; M2 -1.59,7.875; M3 1.59,7.875; M4 1.59,-7.875

### Placement (x,y rotation side)
AGND1  41,46 0 top
AGND2  41,6 0 top
CA1  21,87 270 top
CA2  17,87 270 top
CD1  39,19 90 top
CD2  35,13 90 top
CD3  35,19 90 top
CD4  44,40 0 top
CD5  44,36 0 top
CD6  49,38 0 top
CD7  49,34 0 top
CD8  38,36 0 top
CD9  38,40 0 top
CD10  26,43 90 top
CD11  30,43 90 top
CIA1  66,9 90 top
CIA2  66,14 90 top
CIB1  66,20 90 top
CIB2  66,25 90 top
CIC1  66,31 90 top
CIC2  66,36 90 top
CIN1  66,42 90 top
CIN2  66,47 90 top
CP1  54.5,80 0 bottom
CP2  57,60 180 bottom
CP3  48,61 90 bottom
CP4  29,64 90 bottom
CVA1  81.5,57 180 bottom
CVA2  81.5,53 0 bottom
CVB1  81.5,70 180 bottom
CVB2  81.5,66 0 bottom
CVC1  81.5,83 180 bottom
CVC2  81.5,79 0 bottom
DIA1  75,9 90 top
DIA2  72,9 270 top
DIA3  75,14 90 top
DIA4  72,14 270 top
DIB1  75,20 90 top
DIB2  72,20 270 top
DIB3  75,25 90 top
DIB4  72,25 270 top
DIC1  75,31 90 top
DIC2  72,31 270 top
DIC3  75,36 90 top
DIC4  72,36 270 top
DIN1  75,42 90 top
DIN2  72,42 270 top
DIN3  75,47 90 top
DIN4  72,47 270 top
DP1  67.5,80 180 bottom
EIA1  78,9 90 top
EIA2  78,14 270 top
EIB1  78,20 90 top
EIB2  78,25 270 top
EIC1  78,31 90 top
EIC2  78,36 270 top
EIN1  78,42 90 top
EIN2  78,47 270 top
EVA1  87,60.5 90 top
EVB1  87,73.5 90 top
EVC1  87,86.5 90 top
FBP1  22,63 180 top
FBP2  29,55 270 top
FBP3  35,55 270 top
IAN  62,14 0 top
IAN_IN  86,14 0 top
IAP  62,9 0 top
IAP_IN  86,9 0 top
IBN  62,25 0 top
IBN_IN  86,25 0 top
IBP  62,20 0 top
IBP_IN  86,20 0 top
ICD1  38,28 90 top
ICN  62,36 0 top
ICN_IN  86,36 0 top
ICP  62,31 0 top
ICP1  52,71 270 bottom
ICP2  39,63 270 bottom
ICP_IN  86,31 0 top
INN  62,47 0 top
INN_IN  86,47 0 top
INP  62,42 0 top
INP_IN  86,42 0 top
JP1  40,85 90 top
JP2  42,72 0 top
LP1  65,70 0 bottom
MODEM  10,63 0 top
PORTA  3,72 90 top
PORTB  3,24 90 top
QD1  28,37 0 top
RBC3  81.5,79 0 top
RD1  39,13 90 top
RIA1  81,9 270 top
RIA2  81,14 270 top
RIA3  69,9 270 top
RIA4  69,14 90 top
RIB1  81,20 270 top
RIB2  81,25 270 top
RIB3  69,20 270 top
RIB4  69,25 90 top
RIC1  81,31 270 top
RIC2  81,36 270 top
RIC3  69,31 270 top
RIC4  69,36 90 top
RIN1  81,42 270 top
RIN2  81,47 270 top
RIN3  69,42 270 top
RIN4  69,47 90 top
RVA1  83,61.5 180 top
RVA2  81.5,57 180 top
RVA3  81.5,53 0 top
RVB1  83,74.5 180 top
RVB2  81.5,70 180 top
RVB3  81.5,66 0 top
RVC1  83,87.5 180 top
RVC2  81.5,83 180 top
SP1  61,88 270 top
VAN  78,53 0 top
VAP  78,57 0 top
VAP_IN  87,55 0 top
VBN  78,66 0 top
VBP  78,70 0 top
VBP_IN  87,68 0 top
VCN  78,79 0 top
VCP  78,83 0 top
VCP_IN  87,81 0 top

### Tracks (layer width: path | path; a pad name or v marks a point on that pad's centre or on a via)
5V  (4 unrouted)
!RESET  (2 unrouted)
+3V3/A  (4 unrouted)
+3V3/AA  (6 unrouted)
+3V3/D  (3 unrouted)
+12V  (2 unrouted)
AGND  (6 unrouted)
  pour Top (isolate 0.6): 90,0 90,51 84,51 84,58.5 81,58.5 81,64.5 84,64.5 84,71.5 81,71.5 81,77.5 84,77.5 84,84.5 81,84.5 81,90 90,90 90,96 74,96 74,65 63,54 23,54 23,0
  pour Bottom (isolate 0.6): 23,0 90,0 90,51 84,51 84,58.5 81,58.5 81,64.5 84,64.5 84,71.5 81,71.5 81,77.5 84,77.5 84,84.5 81,84.5 81,90 90,90 90,96 74,96 74,65 63,54 23,54
AVDDOUT  (2 unrouted)
CLKIN  (2 unrouted)
CLKOUT  (2 unrouted)
DGND
  pour Top (isolate 0.5): 0,96 0,0 21,0 21,69 35,69 35,96
  pour Bottom (isolate 0.5): 0,96 0,0 21,0 21,69 35,69 35,93 35,96 21,96
DVDDOUT  (2 unrouted)
GND
  pour Bottom (isolate 1): 37,56 62,56 72,66 72,96 37,96 37,67 23,67 23,56
  pour Top (isolate 1): 37,56 62,56 72,66 72,96 37,96 37,68 37,67 23,67 23,65 23,58 23,56
IAN  (3 unrouted)
IAP  (3 unrouted)
IBN  (3 unrouted)
IBP  (3 unrouted)
ICN  (3 unrouted)
ICP  (3 unrouted)
INN  (3 unrouted)
INP  (3 unrouted)
N$1  (2 unrouted)
N$3  (1 unrouted)
N$5  (2 unrouted)
N$6  (2 unrouted)
N$14  (3 unrouted)
N$15  (3 unrouted)
N$23  (2 unrouted)
N$26  (2 unrouted)
N$27  (3 unrouted)
N$30  (3 unrouted)
N$32  (2 unrouted)
N$33  (2 unrouted)
N$34  (3 unrouted)
N$35  (3 unrouted)
N$36  (1 unrouted)
N$37  (1 unrouted)
N$51  (2 unrouted)
N$52  (2 unrouted)
N$53  (3 unrouted)
N$54  (3 unrouted)
REF  (2 unrouted)
SW  (2 unrouted)
VAN  (3 unrouted)
VAP  (4 unrouted)
VAP_IN  (1 unrouted)
VBN  (3 unrouted)
VBP  (4 unrouted)
VBP_IN  (1 unrouted)
VCN  (3 unrouted)
VCP  (4 unrouted)
VCP_IN  (1 unrouted)

### Text on the board
tPlace: VER. 1.0.0 | REV. 1020 | Ing. JAMM | GEO-HEX-1.0.0